# EAGLE board agatbreadboardshort (EAGLE 7.5.0), part 1 of 3
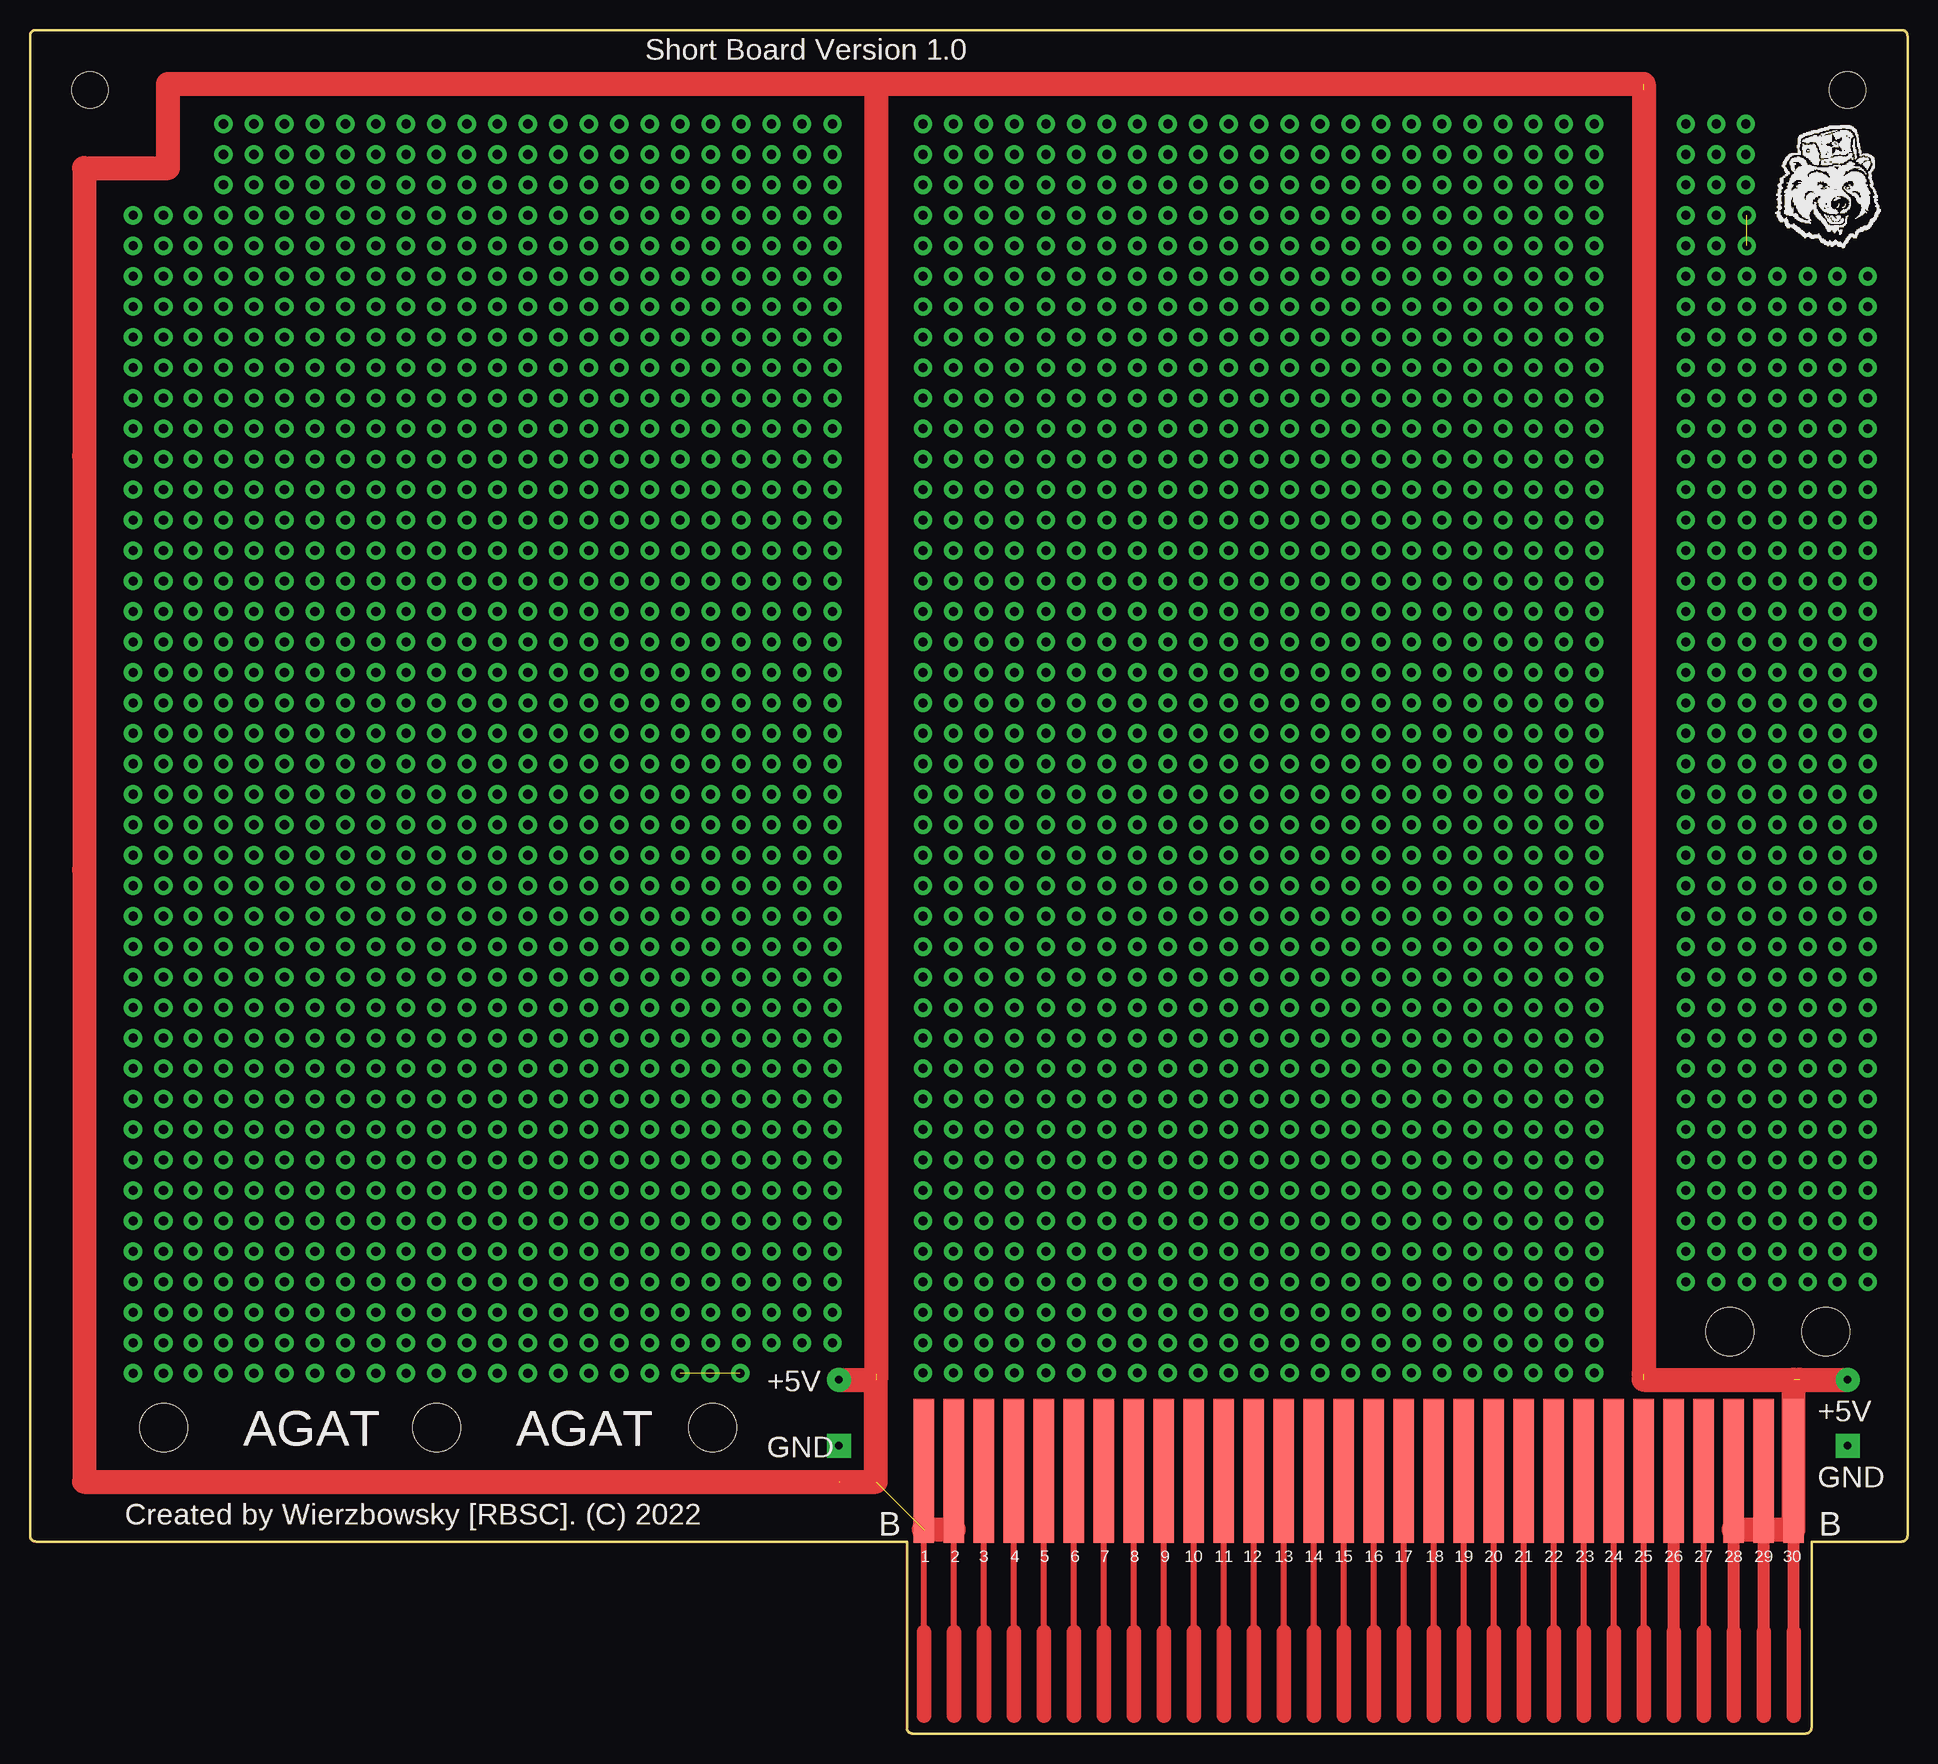
[diagram p1: board, top side]
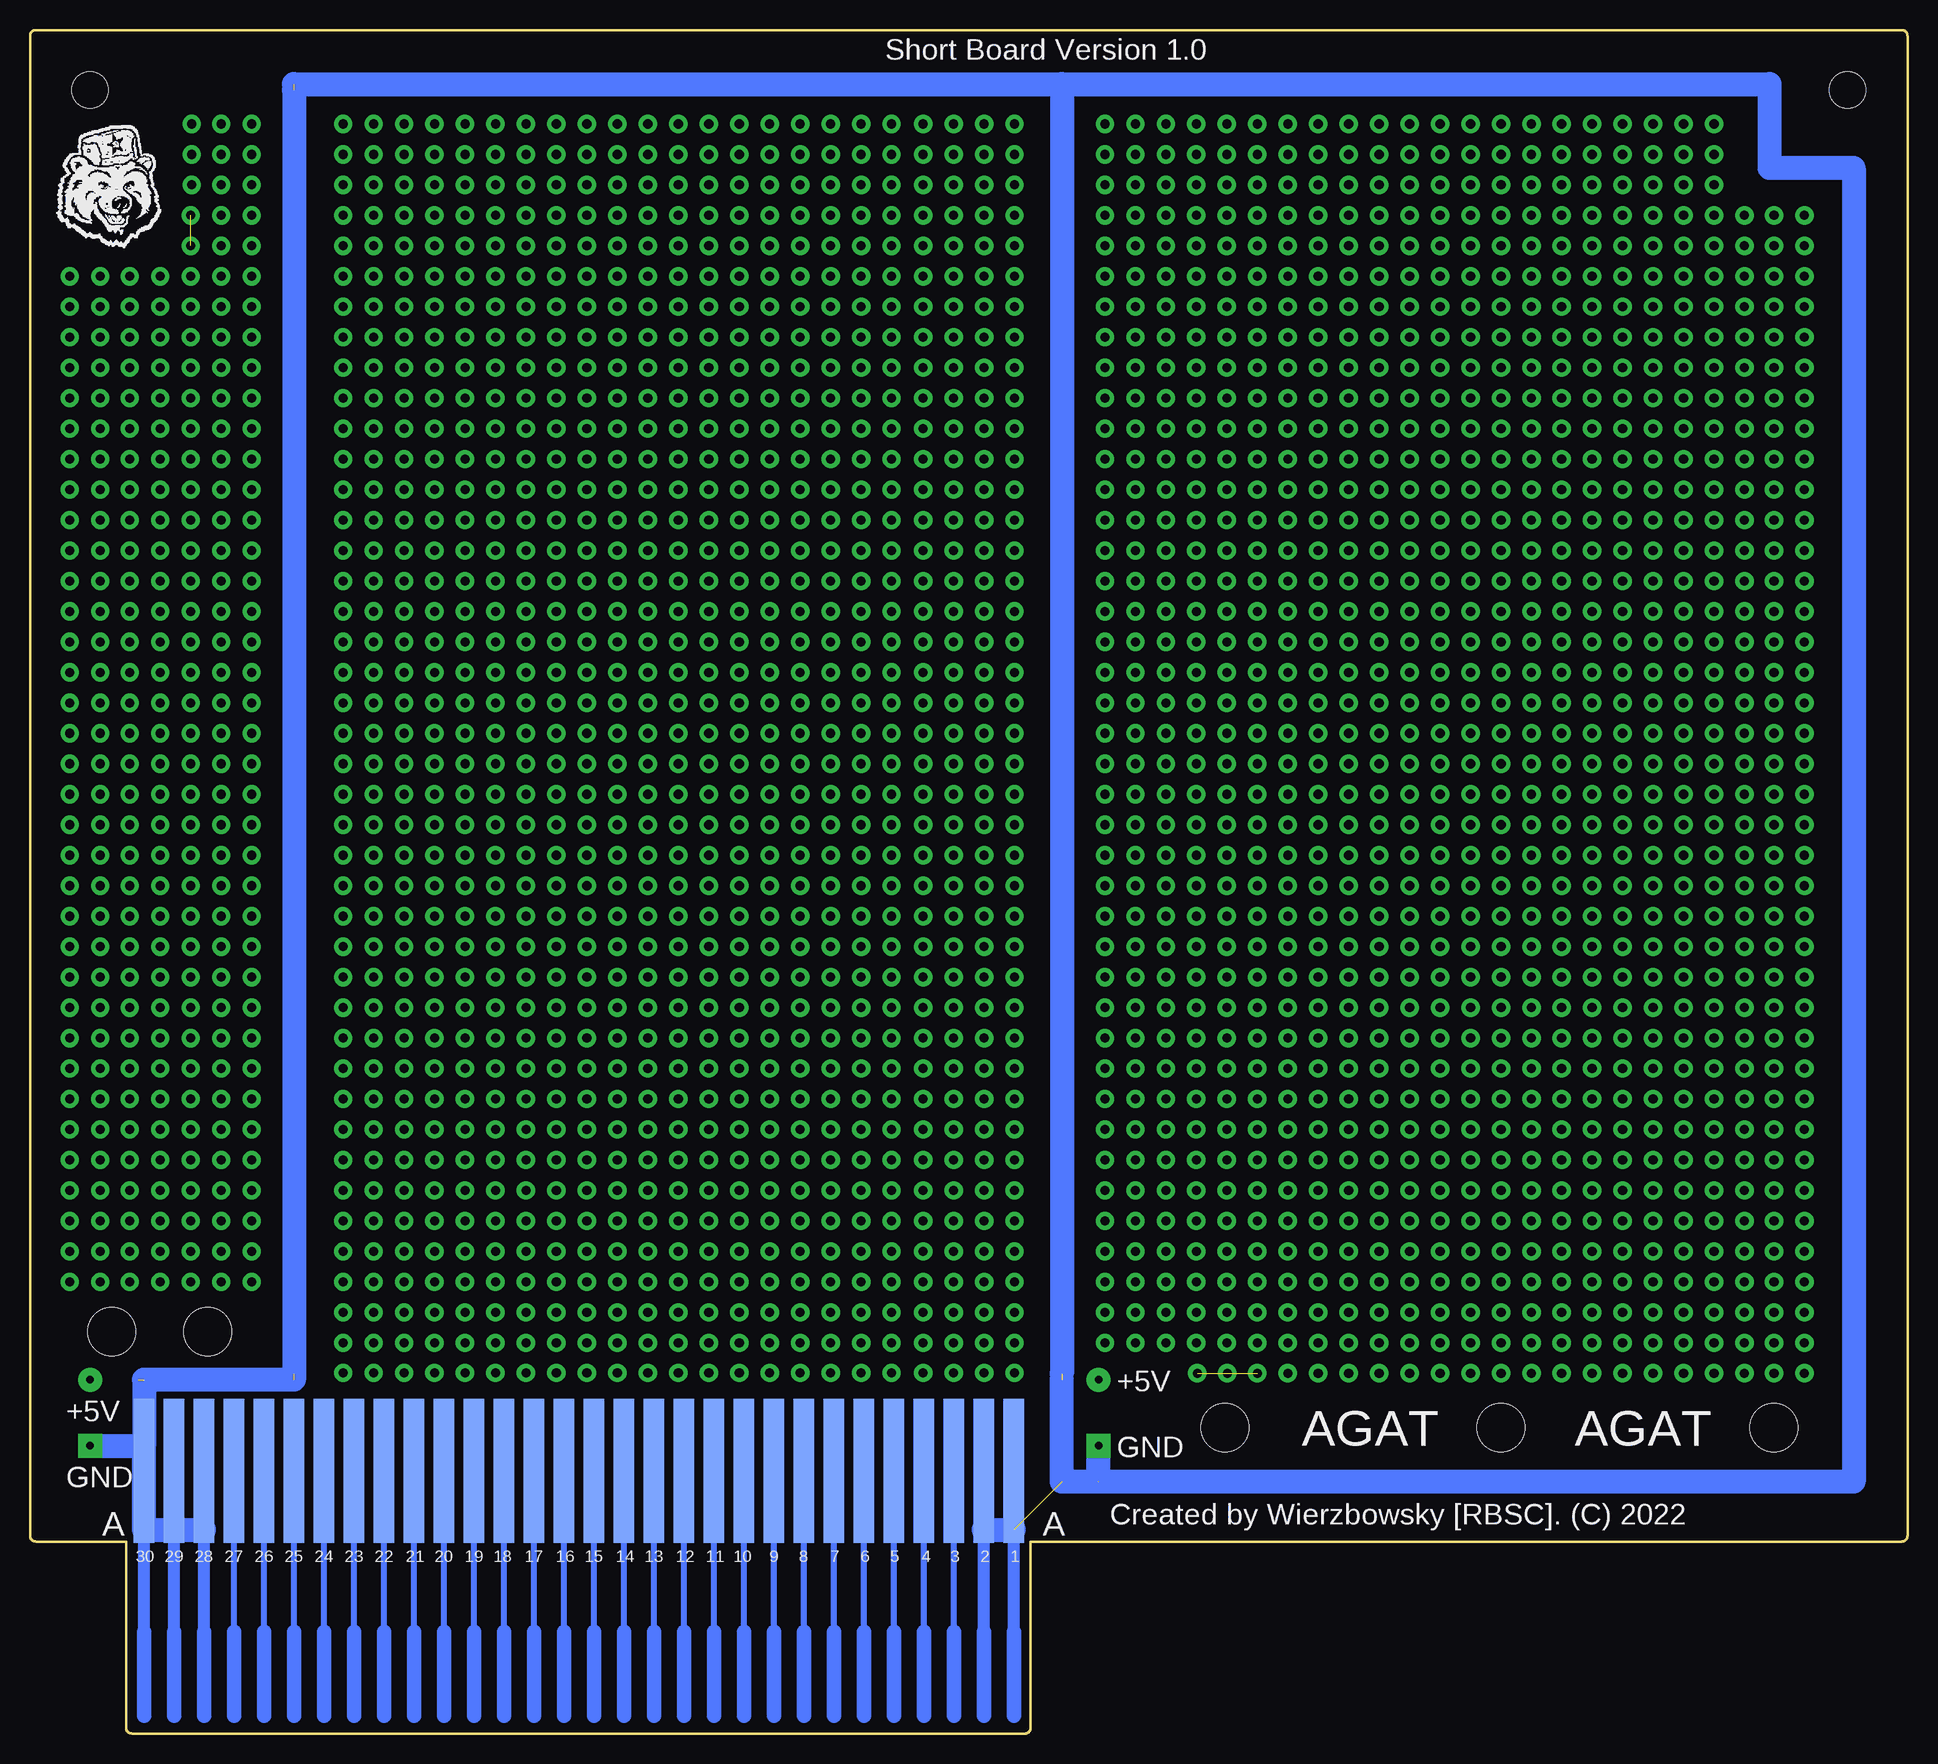
[diagram p2: board, bottom side, seen from below]

Size 156.5 x 142 mm. Coordinates in mm from the lower left corner, seen from the top.
Outline: 0.5,142 156,142 arc-90 156.5,141.5 156.5,16.5 arc-90 156,16 148.5,16 148.5,0.5 arc-90 148,0 73.5,0 arc-90 73.1,0.5 73.1,16 0.5,16 arc-90 0,16.5 0,141.5 arc-90 0.5,142
Copper layers (1*16): Top 0.035mm / dielectric 1.5mm / Bottom 0.035mm
Design rules "default": minimum track width 10mil, minimum drill 24mil, track to track 8mil, track to pad 8mil, pad to pad 8mil, via to via 8mil, smd to smd 8mil, copper to edge 40mil, drill to drill 8mil, minimum pad ring 10mil, minimum via ring 8mil, stop-mask expansion 4mil, vias tented up to drill 0mil, thermal gap 10mil
Holes 3 mm at 5,137 151.5,137
Holes 4 mm at 33.9,25.5 56.9,25.5 149.7,33.5 141.7,33.5 11.15,25.5

## Footprints (pad centres in the part's own frame; a part is rotated, then mirrored left to right if it is on the bottom)
AGAT_CONP = smd 1.7 x 12 bottom: A1 -75,21.9; A2 -72.5,21.9; A3 -70,21.9; A4 -67.5,21.9; A5 -65,21.9; A6 -62.5,21.9; A7 -60,21.9; A8 -57.5,21.9; A9 -55,21.9; A10 -52.5,21.9; A11 -50,21.9; A12 -47.5,21.9; A13 -45,21.9; A14 -42.5,21.9; A15 -40,21.9; A16 -37.5,21.9; A17 -35,21.9; A18 -32.5,21.9; A19 -30,21.9; A20 -27.5,21.9; A21 -25,21.9; A22 -22.5,21.9; A23 -20,21.9; A24 -17.5,21.9; A25 -15,21.9; A26 -12.5,21.9; A27 -10,21.9; A28 -7.5,21.9; A29 -5,21.9; A30 -2.5,21.9 | smd 1.7 x 12: B1 -75,21.9; B2 -72.5,21.9; B3 -70,21.9; B4 -67.5,21.9; B5 -65,21.9; B6 -62.5,21.9; B7 -60,21.9; B8 -57.5,21.9; B9 -55,21.9; B10 -52.5,21.9; B11 -50,21.9; B12 -47.5,21.9; B13 -45,21.9; B14 -42.5,21.9; B15 -40,21.9; B16 -37.5,21.9; B17 -35,21.9; B18 -32.5,21.9; B19 -30,21.9; B20 -27.5,21.9; B21 -25,21.9; B22 -22.5,21.9; B23 -20,21.9; B24 -17.5,21.9; B25 -15,21.9; B26 -12.5,21.9; B27 -10,21.9; B28 -7.5,21.9; B29 -5,21.9; B30 -2.5,21.9

## Placement (x,y rotation side)
EDG1  [AGAT_CONP]  149.5,0 0 top

## Tracks (layer width: path | path; a pad name or v marks a point on that pad's centre or on a via)
+5V  (via drill 0.6 pad 2)  (3 unrouted)
  Top 1: 4.5,106.54 4.5,106.5 | 4.5,71.54 4.5,72
  Top 2: 70.5,137.5 134.5,137.5 134.5,30 | 70.5,137.5 11.5,137.5 11.5,130.5 4.5,130.5 4.5,106.5 4.5,72 4.5,21 70.5,21 70.5,29.5 | 134.5,29.5 147,29.5 147,17 142,17 | 147.5,29.5 v151.5,29.5 | 70.5,137.5 70.5,29.5 | v67.42,29.5 70.5,29.5
  Bottom 2: 77,17 74.5,17
GND  (via drill 0.6 pad 2)  (3 unrouted)
  Bottom 2: 134.5,137.5 11.5,137.5 11.5,130.5 4.5,130.5 4.5,21 67.42,21 v67.42,24 | 67.5,21 70.5,21 70.5,29.5 | 70.5,137.5 70.5,30 | 134.5,137 134.5,29.5 147,29.5 147,24 | 147,24 147,17 142,17 | v151.5,24 147,24
HOLE1  (via drill 0.76 pad 1.52)
  other vias: 107.54,30.07
HOLE2  (via drill 0.76 pad 1.52)
  other vias: 97.38,30.07
HOLE3  (via drill 0.76 pad 1.52)
  other vias: 26.29,47.81
HOLE4  (via drill 0.76 pad 1.52)
  other vias: 26.29,50.35
HOLE5  (via drill 0.76 pad 1.52)
  other vias: 26.29,52.89
HOLE6  (via drill 0.76 pad 1.52)
  other vias: 26.29,55.43
HOLE7  (via drill 0.76 pad 1.52)
  other vias: 26.29,57.97
HOLE8  (via drill 0.76 pad 1.52)
  other vias: 26.29,60.51
HOLE9  (via drill 0.76 pad 1.52)
  other vias: 26.29,63.05
HOLE10  (via drill 0.76 pad 1.52)
  other vias: 26.29,65.59
HOLE11  (via drill 0.76 pad 1.52)
  other vias: 26.29,68.13
HOLE12  (via drill 0.76 pad 1.52)
  other vias: 26.29,70.67
HOLE13  (via drill 0.76 pad 1.52)
  other vias: 26.29,73.21
HOLE14  (via drill 0.76 pad 1.52)
  other vias: 26.29,75.75
HOLE15  (via drill 0.76 pad 1.52)
  other vias: 26.29,78.29
HOLE16  (via drill 0.76 pad 1.52)
  other vias: 26.29,80.83
HOLE17  (via drill 0.76 pad 1.52)
  other vias: 26.29,83.37
HOLE18  (via drill 0.76 pad 1.52)
  other vias: 26.29,85.91
HOLE19  (via drill 0.76 pad 1.52)
  other vias: 26.29,88.45
HOLE20  (via drill 0.76 pad 1.52)
  other vias: 26.29,90.99
HOLE21  (via drill 0.76 pad 1.52)
  other vias: 26.29,93.53
HOLE22  (via drill 0.76 pad 1.52)
  other vias: 26.29,96.07
HOLE23  (via drill 0.76 pad 1.52)
  other vias: 26.29,98.61
HOLE24  (via drill 0.76 pad 1.52)
  other vias: 26.29,101.15
HOLE25  (via drill 0.76 pad 1.52)
  other vias: 26.29,103.69
HOLE26  (via drill 0.76 pad 1.52)
  other vias: 26.29,106.23
HOLE27  (via drill 0.76 pad 1.52)
  other vias: 26.29,108.77
HOLE28  (via drill 0.76 pad 1.52)
  other vias: 26.29,111.31
HOLE29  (via drill 0.76 pad 1.52)
  other vias: 26.29,113.85
HOLE30  (via drill 0.76 pad 1.52)
  other vias: 26.29,116.39
HOLE31  (via drill 0.76 pad 1.52)
  other vias: 26.29,118.93
HOLE32  (via drill 0.76 pad 1.52)
  other vias: 26.29,121.47
HOLE33  (via drill 0.76 pad 1.52)
  other vias: 26.29,124.01
HOLE34  (via drill 0.76 pad 1.52)
  other vias: 26.29,126.55
HOLE35  (via drill 0.76 pad 1.52)
  other vias: 26.29,129.09
HOLE36  (via drill 0.76 pad 1.52)
  other vias: 26.29,131.63
HOLE37  (via drill 0.76 pad 1.52)
  other vias: 26.29,134.17
HOLE38  (via drill 0.76 pad 1.52)
  other vias: 26.29,30.03
HOLE39  (via drill 0.76 pad 1.52)
  other vias: 26.29,32.57
HOLE40  (via drill 0.76 pad 1.52)
  other vias: 26.29,35.11
HOLE41  (via drill 0.76 pad 1.52)
  other vias: 26.29,37.65
HOLE42  (via drill 0.76 pad 1.52)
  other vias: 26.29,40.19
HOLE43  (via drill 0.76 pad 1.52)
  other vias: 26.29,42.73
HOLE44  (via drill 0.76 pad 1.52)
  other vias: 26.29,45.27
HOLE279  (via drill 0.76 pad 1.52)
  other vias: 54.2,47.81
HOLE280  (via drill 0.76 pad 1.52)
  other vias: 44.04,47.81
HOLE281  (via drill 0.76 pad 1.52)
  other vias: 54.2,50.35
HOLE282  (via drill 0.76 pad 1.52)
  other vias: 44.04,50.35
HOLE283  (via drill 0.76 pad 1.52)
  other vias: 54.2,52.89
HOLE284  (via drill 0.76 pad 1.52)
  other vias: 44.04,52.89
HOLE285  (via drill 0.76 pad 1.52)
  other vias: 54.2,55.43
HOLE286  (via drill 0.76 pad 1.52)
  other vias: 44.04,55.43
HOLE287  (via drill 0.76 pad 1.52)
  other vias: 54.2,57.97
HOLE288  (via drill 0.76 pad 1.52)
  other vias: 44.04,57.97
HOLE289  (via drill 0.76 pad 1.52)
  other vias: 54.2,60.51
HOLE290  (via drill 0.76 pad 1.52)
  other vias: 44.04,60.51
HOLE291  (via drill 0.76 pad 1.52)
  other vias: 54.2,63.05
HOLE292  (via drill 0.76 pad 1.52)
  other vias: 44.04,63.05
HOLE293  (via drill 0.76 pad 1.52)
  other vias: 54.2,65.59
HOLE294  (via drill 0.76 pad 1.52)
  other vias: 44.04,65.59
HOLE295  (via drill 0.76 pad 1.52)
  other vias: 54.2,68.13
HOLE296  (via drill 0.76 pad 1.52)
  other vias: 44.04,68.13
HOLE297  (via drill 0.76 pad 1.52)
  other vias: 54.2,70.67
HOLE298  (via drill 0.76 pad 1.52)
  other vias: 44.04,70.67
HOLE299  (via drill 0.76 pad 1.52)
  other vias: 54.2,73.21
HOLE300  (via drill 0.76 pad 1.52)
  other vias: 44.04,73.21
HOLE301  (via drill 0.76 pad 1.52)
  other vias: 54.2,75.75
HOLE302  (via drill 0.76 pad 1.52)
  other vias: 44.04,75.75
HOLE303  (via drill 0.76 pad 1.52)
  other vias: 54.2,78.29
HOLE304  (via drill 0.76 pad 1.52)
  other vias: 44.04,78.29
HOLE305  (via drill 0.76 pad 1.52)
  other vias: 54.2,80.83
HOLE306  (via drill 0.76 pad 1.52)
  other vias: 44.04,80.83
HOLE307  (via drill 0.76 pad 1.52)
  other vias: 54.2,83.37
HOLE308  (via drill 0.76 pad 1.52)
  other vias: 44.04,83.37
HOLE309  (via drill 0.76 pad 1.52)
  other vias: 54.2,85.91
HOLE310  (via drill 0.76 pad 1.52)
  other vias: 44.04,85.91
HOLE311  (via drill 0.76 pad 1.52)
  other vias: 54.2,88.45
HOLE312  (via drill 0.76 pad 1.52)
  other vias: 44.04,88.45
HOLE313  (via drill 0.76 pad 1.52)
  other vias: 54.2,90.99
HOLE314  (via drill 0.76 pad 1.52)
  other vias: 44.04,90.99
HOLE315  (via drill 0.76 pad 1.52)
  other vias: 54.2,93.53
HOLE316  (via drill 0.76 pad 1.52)
  other vias: 44.04,93.53
HOLE317  (via drill 0.76 pad 1.52)
  other vias: 54.2,96.07
HOLE318  (via drill 0.76 pad 1.52)
  other vias: 44.04,96.07
HOLE319  (via drill 0.76 pad 1.52)
  other vias: 54.2,98.61
HOLE320  (via drill 0.76 pad 1.52)
  other vias: 44.04,98.61
HOLE321  (via drill 0.76 pad 1.52)
  other vias: 54.2,101.15
HOLE322  (via drill 0.76 pad 1.52)
  other vias: 44.04,101.15
HOLE323  (via drill 0.76 pad 1.52)
  other vias: 54.2,103.69
HOLE324  (via drill 0.76 pad 1.52)
  other vias: 44.04,103.69
HOLE325  (via drill 0.76 pad 1.52)
  other vias: 54.2,106.23
HOLE326  (via drill 0.76 pad 1.52)
  other vias: 44.04,106.23
HOLE327  (via drill 0.76 pad 1.52)
  other vias: 54.2,108.77
HOLE328  (via drill 0.76 pad 1.52)
  other vias: 44.04,108.77
HOLE329  (via drill 0.76 pad 1.52)
  other vias: 54.2,111.31
HOLE330  (via drill 0.76 pad 1.52)
  other vias: 44.04,111.31
HOLE331  (via drill 0.76 pad 1.52)
  other vias: 54.2,113.85
HOLE332  (via drill 0.76 pad 1.52)
  other vias: 44.04,113.85
HOLE333  (via drill 0.76 pad 1.52)
  other vias: 54.2,116.39
HOLE334  (via drill 0.76 pad 1.52)
  other vias: 44.04,116.39
HOLE335  (via drill 0.76 pad 1.52)
  other vias: 54.2,118.93
HOLE336  (via drill 0.76 pad 1.52)
  other vias: 44.04,118.93
HOLE337  (via drill 0.76 pad 1.52)
  other vias: 54.2,121.47
HOLE338  (via drill 0.76 pad 1.52)
  other vias: 44.04,121.47
HOLE339  (via drill 0.76 pad 1.52)
  other vias: 54.2,124.01
HOLE340  (via drill 0.76 pad 1.52)
  other vias: 44.04,124.01
HOLE341  (via drill 0.76 pad 1.52)
  other vias: 54.2,126.55
HOLE342  (via drill 0.76 pad 1.52)
  other vias: 44.04,126.55
HOLE343  (via drill 0.76 pad 1.52)
  other vias: 54.2,129.09
HOLE344  (via drill 0.76 pad 1.52)
  other vias: 44.04,129.09
HOLE345  (via drill 0.76 pad 1.52)
  other vias: 54.2,131.63
HOLE346  (via drill 0.76 pad 1.52)
  other vias: 44.04,131.63
HOLE347  (via drill 0.76 pad 1.52)
  other vias: 54.2,134.17
HOLE348  (via drill 0.76 pad 1.52)
  other vias: 44.04,134.17
HOLE349  (via drill 0.76 pad 1.52)  (2 unrouted)
  other vias: 54.2,30.03 56.7,30.03 59.2,30.03
HOLE350  (via drill 0.76 pad 1.52)
  other vias: 44.04,30.03
HOLE351  (via drill 0.76 pad 1.52)
  other vias: 54.2,32.57
HOLE352  (via drill 0.76 pad 1.52)
  other vias: 44.04,32.57
HOLE353  (via drill 0.76 pad 1.52)
  other vias: 54.2,35.11
HOLE354  (via drill 0.76 pad 1.52)
  other vias: 44.04,35.11
HOLE355  (via drill 0.76 pad 1.52)
  other vias: 54.2,37.65
HOLE356  (via drill 0.76 pad 1.52)
  other vias: 44.04,37.65
HOLE357  (via drill 0.76 pad 1.52)
  other vias: 54.2,40.19
HOLE358  (via drill 0.76 pad 1.52)
  other vias: 44.04,40.19
HOLE359  (via drill 0.76 pad 1.52)
  other vias: 54.2,42.73
HOLE360  (via drill 0.76 pad 1.52)
  other vias: 44.04,42.73
HOLE361  (via drill 0.76 pad 1.52)
  other vias: 54.2,45.27
HOLE362  (via drill 0.76 pad 1.52)
  other vias: 44.04,45.27
HOLE363  (via drill 0.76 pad 1.52)
  other vias: 107.54,47.81
HOLE364  (via drill 0.76 pad 1.52)
  other vias: 97.38,47.81
HOLE365  (via drill 0.76 pad 1.52)
  other vias: 107.54,50.35
HOLE366  (via drill 0.76 pad 1.52)
  other vias: 97.38,50.35
HOLE367  (via drill 0.76 pad 1.52)
  other vias: 107.54,52.89
HOLE368  (via drill 0.76 pad 1.52)
  other vias: 97.38,52.89
HOLE369  (via drill 0.76 pad 1.52)
  other vias: 107.54,55.43
HOLE370  (via drill 0.76 pad 1.52)
  other vias: 97.38,55.43
HOLE371  (via drill 0.76 pad 1.52)
  other vias: 107.54,57.97
HOLE372  (via drill 0.76 pad 1.52)
  other vias: 97.38,57.97
HOLE373  (via drill 0.76 pad 1.52)
  other vias: 107.54,60.51
HOLE374  (via drill 0.76 pad 1.52)
  other vias: 97.38,60.51
HOLE375  (via drill 0.76 pad 1.52)
  other vias: 107.54,63.05
HOLE376  (via drill 0.76 pad 1.52)
  other vias: 97.38,63.05
HOLE377  (via drill 0.76 pad 1.52)
  other vias: 107.54,65.59
HOLE378  (via drill 0.76 pad 1.52)
  other vias: 97.38,65.59
HOLE379  (via drill 0.76 pad 1.52)
  other vias: 107.54,68.13
HOLE380  (via drill 0.76 pad 1.52)
  other vias: 97.38,68.13
HOLE381  (via drill 0.76 pad 1.52)
  other vias: 107.54,70.67
HOLE382  (via drill 0.76 pad 1.52)
  other vias: 97.38,70.67
HOLE383  (via drill 0.76 pad 1.52)
  other vias: 107.54,73.21
HOLE384  (via drill 0.76 pad 1.52)
  other vias: 97.38,73.21
HOLE385  (via drill 0.76 pad 1.52)
  other vias: 107.54,75.75
HOLE386  (via drill 0.76 pad 1.52)
  other vias: 97.38,75.75
HOLE387  (via drill 0.76 pad 1.52)
  other vias: 107.54,78.29
HOLE388  (via drill 0.76 pad 1.52)
  other vias: 97.38,78.29
HOLE389  (via drill 0.76 pad 1.52)
  other vias: 107.54,80.83
HOLE390  (via drill 0.76 pad 1.52)
  other vias: 97.38,80.83
HOLE391  (via drill 0.76 pad 1.52)
  other vias: 107.54,83.37
HOLE392  (via drill 0.76 pad 1.52)
  other vias: 97.38,83.37
HOLE393  (via drill 0.76 pad 1.52)
  other vias: 107.54,85.91
HOLE394  (via drill 0.76 pad 1.52)
  other vias: 97.38,85.91
HOLE395  (via drill 0.76 pad 1.52)
  other vias: 107.54,88.45
HOLE396  (via drill 0.76 pad 1.52)
  other vias: 97.38,88.45
HOLE397  (via drill 0.76 pad 1.52)
  other vias: 107.54,90.99
HOLE398  (via drill 0.76 pad 1.52)
  other vias: 97.38,90.99
HOLE399  (via drill 0.76 pad 1.52)
  other vias: 107.54,93.53
HOLE400  (via drill 0.76 pad 1.52)
  other vias: 97.38,93.53
HOLE401  (via drill 0.76 pad 1.52)
  other vias: 107.54,96.07
HOLE402  (via drill 0.76 pad 1.52)
  other vias: 97.38,96.07
HOLE403  (via drill 0.76 pad 1.52)
  other vias: 107.54,98.61
HOLE404  (via drill 0.76 pad 1.52)
  other vias: 97.38,98.61
HOLE405  (via drill 0.76 pad 1.52)
  other vias: 107.54,101.15
HOLE406  (via drill 0.76 pad 1.52)
  other vias: 97.38,101.15
HOLE407  (via drill 0.76 pad 1.52)
  other vias: 107.54,103.69
HOLE408  (via drill 0.76 pad 1.52)
  other vias: 97.38,103.69
HOLE409  (via drill 0.76 pad 1.52)
  other vias: 107.54,106.23
HOLE410  (via drill 0.76 pad 1.52)
  other vias: 97.38,106.23
HOLE411  (via drill 0.76 pad 1.52)
  other vias: 107.54,108.77
HOLE412  (via drill 0.76 pad 1.52)
  other vias: 97.38,108.77
HOLE413  (via drill 0.76 pad 1.52)
  other vias: 107.54,111.31
HOLE414  (via drill 0.76 pad 1.52)
  other vias: 97.38,111.31
HOLE415  (via drill 0.76 pad 1.52)
  other vias: 107.54,113.85
HOLE416  (via drill 0.76 pad 1.52)
  other vias: 97.38,113.85
HOLE417  (via drill 0.76 pad 1.52)
  other vias: 107.54,116.39
HOLE418  (via drill 0.76 pad 1.52)
  other vias: 97.38,116.39
HOLE419  (via drill 0.76 pad 1.52)
  other vias: 107.54,118.93
HOLE420  (via drill 0.76 pad 1.52)
  other vias: 97.38,118.93
HOLE421  (via drill 0.76 pad 1.52)
  other vias: 107.54,121.47
HOLE422  (via drill 0.76 pad 1.52)
  other vias: 97.38,121.47
HOLE423  (via drill 0.76 pad 1.52)
  other vias: 107.54,124.01
HOLE424  (via drill 0.76 pad 1.52)
  other vias: 97.38,124.01
HOLE425  (via drill 0.76 pad 1.52)
  other vias: 107.54,126.55
HOLE426  (via drill 0.76 pad 1.52)
  other vias: 97.38,126.55
HOLE427  (via drill 0.76 pad 1.52)
  other vias: 107.54,129.09
HOLE428  (via drill 0.76 pad 1.52)
  other vias: 97.38,129.09
HOLE429  (via drill 0.76 pad 1.52)
  other vias: 107.54,131.63
HOLE430  (via drill 0.76 pad 1.52)
  other vias: 97.38,131.63
HOLE431  (via drill 0.76 pad 1.52)
  other vias: 107.54,134.17
HOLE432  (via drill 0.76 pad 1.52)
  other vias: 97.38,134.17
HOLE435  (via drill 0.76 pad 1.52)
  other vias: 107.54,32.57
HOLE436  (via drill 0.76 pad 1.52)
  other vias: 97.38,32.57
HOLE437  (via drill 0.76 pad 1.52)
  other vias: 107.54,35.11
HOLE438  (via drill 0.76 pad 1.52)
  other vias: 97.38,35.11
HOLE439  (via drill 0.76 pad 1.52)
  other vias: 107.54,37.65
HOLE440  (via drill 0.76 pad 1.52)
  other vias: 97.38,37.65
HOLE441  (via drill 0.76 pad 1.52)
  other vias: 107.54,40.19
HOLE442  (via drill 0.76 pad 1.52)
  other vias: 97.38,40.19
HOLE443  (via drill 0.76 pad 1.52)
  other vias: 107.54,42.73
HOLE444  (via drill 0.76 pad 1.52)
  other vias: 97.38,42.73
HOLE445  (via drill 0.76 pad 1.52)
  other vias: 107.54,45.27
HOLE446  (via drill 0.76 pad 1.52)
  other vias: 97.38,45.27
N$1  (via drill 0.76 pad 1.52)
  other vias: 112.62,30.07
N$2  (via drill 0.76 pad 1.52)
  other vias: 110.08,30.07
N$3  (via drill 0.76 pad 1.52)
  other vias: 117.7,30.07
N$4  (via drill 0.76 pad 1.52)
  other vias: 115.16,30.07
N$5  (via drill 0.76 pad 1.52)
  other vias: 122.78,30.07
N$6  (via drill 0.76 pad 1.52)
  other vias: 120.24,30.07
N$7  (via drill 0.76 pad 1.52)
  other vias: 127.86,30.07
N$8  (via drill 0.76 pad 1.52)
  other vias: 125.32,30.07
N$9  (via drill 0.76 pad 1.52)
  other vias: 130.4,30.07
N$10  (via drill 0.76 pad 1.52)
  other vias: 153.18,47.81
N$11  (via drill 0.76 pad 1.52)
  other vias: 150.64,47.81
N$12  (via drill 0.76 pad 1.52)
  other vias: 153.18,50.35
N$13  (via drill 0.76 pad 1.52)
  other vias: 150.64,50.35
N$14  (via drill 0.76 pad 1.52)
  other vias: 153.18,52.89
N$15  (via drill 0.76 pad 1.52)
  other vias: 150.64,52.89
N$16  (via drill 0.76 pad 1.52)
  other vias: 153.18,55.43
N$17  (via drill 0.76 pad 1.52)
  other vias: 150.64,55.43
N$18  (via drill 0.76 pad 1.52)
  other vias: 153.18,57.97
N$19  (via drill 0.76 pad 1.52)
  other vias: 150.64,57.97
N$20  (via drill 0.76 pad 1.52)
  other vias: 153.18,60.51
N$21  (via drill 0.76 pad 1.52)
  other vias: 150.64,60.51
N$22  (via drill 0.76 pad 1.52)
  other vias: 153.18,63.05
N$23  (via drill 0.76 pad 1.52)
  other vias: 150.64,63.05
N$24  (via drill 0.76 pad 1.52)
  other vias: 153.18,65.59
N$25  (via drill 0.76 pad 1.52)
  other vias: 150.64,65.59
N$26  (via drill 0.76 pad 1.52)
  other vias: 153.18,68.13
N$27  (via drill 0.76 pad 1.52)
  other vias: 150.64,68.13
N$28  (via drill 0.76 pad 1.52)
  other vias: 153.18,70.67
N$29  (via drill 0.76 pad 1.52)
  other vias: 150.64,70.67
N$30  (via drill 0.76 pad 1.52)
  other vias: 153.18,73.21
N$31  (via drill 0.76 pad 1.52)
  other vias: 150.64,73.21
N$32  (via drill 0.76 pad 1.52)
  other vias: 153.18,75.75
N$33  (via drill 0.76 pad 1.52)
  other vias: 150.64,75.75
N$34  (via drill 0.76 pad 1.52)
  other vias: 153.18,78.29
N$35  (via drill 0.76 pad 1.52)
  other vias: 150.64,78.29
N$36  (via drill 0.76 pad 1.52)
  other vias: 153.18,80.83
N$37  (via drill 0.76 pad 1.52)
  other vias: 150.64,80.83
N$38  (via drill 0.76 pad 1.52)
  other vias: 153.18,83.37
N$39  (via drill 0.76 pad 1.52)
  other vias: 150.64,83.37
N$40  (via drill 0.76 pad 1.52)
  other vias: 153.18,85.91
N$41  (via drill 0.76 pad 1.52)
  other vias: 150.64,85.91
N$42  (via drill 0.76 pad 1.52)
  other vias: 153.18,88.45
N$43  (via drill 0.76 pad 1.52)
  other vias: 150.64,88.45
N$44  (via drill 0.76 pad 1.52)
  other vias: 153.18,90.99
N$45  (via drill 0.76 pad 1.52)
  other vias: 150.64,90.99
N$46  (via drill 0.76 pad 1.52)
  other vias: 153.18,93.53
N$47  (via drill 0.76 pad 1.52)
  other vias: 150.64,93.53
N$48  (via drill 0.76 pad 1.52)
  other vias: 153.18,96.07
N$49  (via drill 0.76 pad 1.52)
  other vias: 150.64,96.07
N$50  (via drill 0.76 pad 1.52)
  other vias: 153.18,98.61
N$51  (via drill 0.76 pad 1.52)
  other vias: 150.64,98.61
N$52  (via drill 0.76 pad 1.52)
  other vias: 153.18,101.15
N$53  (via drill 0.76 pad 1.52)
  other vias: 150.64,101.15
N$54  (via drill 0.76 pad 1.52)
  other vias: 153.18,103.69
N$55  (via drill 0.76 pad 1.52)
  other vias: 150.64,103.69
N$56  (via drill 0.76 pad 1.52)
  other vias: 153.18,106.23
N$57  (via drill 0.76 pad 1.52)
  other vias: 150.64,106.23
N$58  (via drill 0.76 pad 1.52)
  other vias: 153.18,108.77
N$59  (via drill 0.76 pad 1.52)
  other vias: 150.64,108.77
N$60  (via drill 0.76 pad 1.52)
  other vias: 153.18,111.31
N$61  (via drill 0.76 pad 1.52)
  other vias: 150.64,111.31
N$62  (via drill 0.76 pad 1.52)
  other vias: 153.18,113.85
N$63  (via drill 0.76 pad 1.52)
  other vias: 150.64,113.85
N$64  (via drill 0.76 pad 1.52)
  other vias: 153.18,116.39
N$65  (via drill 0.76 pad 1.52)
  other vias: 150.64,116.39
N$66  (via drill 0.76 pad 1.52)
  other vias: 153.18,118.93
N$67  (via drill 0.76 pad 1.52)
  other vias: 150.64,118.93
N$68  (via drill 0.76 pad 1.52)
  other vias: 153.18,121.47
N$69  (via drill 0.76 pad 1.52)
  other vias: 150.64,121.47
N$70  (via drill 0.76 pad 1.52)
  other vias: 99.92,30.07
N$71  (via drill 0.76 pad 1.52)
  other vias: 102.46,30.07
N$72  (via drill 0.76 pad 1.52)
  other vias: 105,30.07
N$73  (via drill 0.76 pad 1.52)
  other vias: 84.68,30.07
N$74  (via drill 0.76 pad 1.52)
  other vias: 87.22,30.07
N$75  (via drill 0.76 pad 1.52)
  other vias: 89.76,30.07
N$76  (via drill 0.76 pad 1.52)
  other vias: 153.18,37.65
N$77  (via drill 0.76 pad 1.52)
  other vias: 150.64,37.65
N$78  (via drill 0.76 pad 1.52)
  other vias: 153.18,40.19
N$79  (via drill 0.76 pad 1.52)
  other vias: 150.64,40.19
N$80  (via drill 0.76 pad 1.52)
  other vias: 153.18,42.73
N$81  (via drill 0.76 pad 1.52)
  other vias: 150.64,42.73
N$82  (via drill 0.76 pad 1.52)
  other vias: 153.18,45.27
N$83  (via drill 0.76 pad 1.52)
  other vias: 150.64,45.27
N$84  (via drill 0.76 pad 1.52)
  other vias: 143.02,129.09
N$85  (via drill 0.76 pad 1.52)
  other vias: 92.3,30.07
N$86  (via drill 0.76 pad 1.52)
  other vias: 143.02,131.63
N$87  (via drill 0.76 pad 1.52)
  other vias: 94.84,30.07
N$88  (via drill 0.76 pad 1.52)
  other vias: 143.02,134.17
N$89
  Top 2: 77,17 74.5,17
N$90  (via drill 0.76 pad 1.52)
  other vias: 28.83,47.81
N$91  (via drill 0.76 pad 1.52)
  other vias: 13.59,47.81
N$92  (via drill 0.76 pad 1.52)
  other vias: 16.13,47.81
N$93  (via drill 0.76 pad 1.52)
  other vias: 18.67,47.81
N$94  (via drill 0.76 pad 1.52)
  other vias: 21.21,47.81
N$95  (via drill 0.76 pad 1.52)
  other vias: 23.75,47.81
N$96  (via drill 0.76 pad 1.52)
  other vias: 28.83,50.35
N$97  (via drill 0.76 pad 1.52)
  other vias: 13.59,50.35
N$98  (via drill 0.76 pad 1.52)
  other vias: 16.13,50.35
N$99  (via drill 0.76 pad 1.52)
  other vias: 18.67,50.35
N$100  (via drill 0.76 pad 1.52)
  other vias: 21.21,50.35
N$101  (via drill 0.76 pad 1.52)
  other vias: 23.75,50.35
N$102  (via drill 0.76 pad 1.52)
  other vias: 28.83,52.89
N$103  (via drill 0.76 pad 1.52)
  other vias: 13.59,52.89
N$104  (via drill 0.76 pad 1.52)
  other vias: 16.13,52.89
N$105  (via drill 0.76 pad 1.52)
  other vias: 18.67,52.89
N$106  (via drill 0.76 pad 1.52)
  other vias: 21.21,52.89
N$107  (via drill 0.76 pad 1.52)
  other vias: 23.75,52.89
N$108  (via drill 0.76 pad 1.52)
  other vias: 28.83,55.43
N$109  (via drill 0.76 pad 1.52)
  other vias: 13.59,55.43
N$110  (via drill 0.76 pad 1.52)
  other vias: 16.13,55.43
N$111  (via drill 0.76 pad 1.52)
  other vias: 18.67,55.43
N$112  (via drill 0.76 pad 1.52)
  other vias: 21.21,55.43
N$113  (via drill 0.76 pad 1.52)
  other vias: 23.75,55.43
N$114  (via drill 0.76 pad 1.52)
  other vias: 28.83,57.97
N$115  (via drill 0.76 pad 1.52)
  other vias: 13.59,57.97
N$116  (via drill 0.76 pad 1.52)
  other vias: 16.13,57.97
N$117  (via drill 0.76 pad 1.52)
  other vias: 18.67,57.97
N$118  (via drill 0.76 pad 1.52)
  other vias: 21.21,57.97
N$119  (via drill 0.76 pad 1.52)
  other vias: 23.75,57.97
N$120  (via drill 0.76 pad 1.52)
  other vias: 28.83,60.51
N$121  (via drill 0.76 pad 1.52)
  other vias: 13.59,60.51
N$122  (via drill 0.76 pad 1.52)
  other vias: 16.13,60.51
N$123  (via drill 0.76 pad 1.52)
  other vias: 18.67,60.51
N$124  (via drill 0.76 pad 1.52)
  other vias: 21.21,60.51
N$125  (via drill 0.76 pad 1.52)
  other vias: 23.75,60.51
N$126  (via drill 0.76 pad 1.52)
  other vias: 28.83,63.05
N$127  (via drill 0.76 pad 1.52)
  other vias: 13.59,63.05
N$128  (via drill 0.76 pad 1.52)
  other vias: 16.13,63.05
N$129  (via drill 0.76 pad 1.52)
  other vias: 18.67,63.05
N$130  (via drill 0.76 pad 1.52)
  other vias: 21.21,63.05
N$131  (via drill 0.76 pad 1.52)
  other vias: 23.75,63.05
N$132  (via drill 0.76 pad 1.52)
  other vias: 28.83,65.59
N$133  (via drill 0.76 pad 1.52)
  other vias: 13.59,65.59
N$134  (via drill 0.76 pad 1.52)
  other vias: 16.13,65.59
N$135  (via drill 0.76 pad 1.52)
  other vias: 18.67,65.59
N$136  (via drill 0.76 pad 1.52)
  other vias: 21.21,65.59
N$137  (via drill 0.76 pad 1.52)
  other vias: 23.75,65.59
N$138  (via drill 0.76 pad 1.52)
  other vias: 28.83,68.13
N$139  (via drill 0.76 pad 1.52)
  other vias: 13.59,68.13
N$140  (via drill 0.76 pad 1.52)
  other vias: 16.13,68.13
N$141  (via drill 0.76 pad 1.52)
  other vias: 18.67,68.13
N$142  (via drill 0.76 pad 1.52)
  other vias: 21.21,68.13
N$143  (via drill 0.76 pad 1.52)
  other vias: 23.75,68.13
N$144  (via drill 0.76 pad 1.52)
  other vias: 28.83,70.67
N$145  (via drill 0.76 pad 1.52)
  other vias: 13.59,70.67
N$146  (via drill 0.76 pad 1.52)
  other vias: 16.13,70.67
N$147  (via drill 0.76 pad 1.52)
  other vias: 18.67,70.67
N$148  (via drill 0.76 pad 1.52)
  other vias: 21.21,70.67
N$149  (via drill 0.76 pad 1.52)
  other vias: 23.75,70.67
N$150  (via drill 0.76 pad 1.52)
  other vias: 28.83,73.21
N$151  (via drill 0.76 pad 1.52)
  other vias: 13.59,73.21
N$152  (via drill 0.76 pad 1.52)
  other vias: 16.13,73.21
N$153  (via drill 0.76 pad 1.52)
  other vias: 18.67,73.21
N$154  (via drill 0.76 pad 1.52)
  other vias: 21.21,73.21
N$155  (via drill 0.76 pad 1.52)
  other vias: 23.75,73.21
N$156  (via drill 0.76 pad 1.52)
  other vias: 28.83,75.75
N$157  (via drill 0.76 pad 1.52)
  other vias: 13.59,75.75
N$158  (via drill 0.76 pad 1.52)
  other vias: 16.13,75.75
N$159  (via drill 0.76 pad 1.52)
  other vias: 18.67,75.75
N$160  (via drill 0.76 pad 1.52)
  other vias: 21.21,75.75
N$161  (via drill 0.76 pad 1.52)
  other vias: 23.75,75.75
N$162  (via drill 0.76 pad 1.52)
  other vias: 28.83,78.29
N$163  (via drill 0.76 pad 1.52)
  other vias: 13.59,78.29
N$164  (via drill 0.76 pad 1.52)
  other vias: 16.13,78.29
N$165  (via drill 0.76 pad 1.52)
  other vias: 18.67,78.29
N$166  (via drill 0.76 pad 1.52)
  other vias: 21.21,78.29
N$167  (via drill 0.76 pad 1.52)
  other vias: 23.75,78.29
N$168  (via drill 0.76 pad 1.52)
  other vias: 28.83,80.83
N$169  (via drill 0.76 pad 1.52)
  other vias: 13.59,80.83
N$170  (via drill 0.76 pad 1.52)
  other vias: 16.13,80.83
N$171  (via drill 0.76 pad 1.52)
  other vias: 18.67,80.83
N$172  (via drill 0.76 pad 1.52)
  other vias: 21.21,80.83
N$173  (via drill 0.76 pad 1.52)
  other vias: 23.75,80.83
N$174  (via drill 0.76 pad 1.52)
  other vias: 28.83,83.37
N$175  (via drill 0.76 pad 1.52)
  other vias: 13.59,83.37
N$176  (via drill 0.76 pad 1.52)
  other vias: 16.13,83.37
N$177  (via drill 0.76 pad 1.52)
  other vias: 18.67,83.37
N$178  (via drill 0.76 pad 1.52)
  other vias: 21.21,83.37
N$179  (via drill 0.76 pad 1.52)
  other vias: 23.75,83.37
N$180  (via drill 0.76 pad 1.52)
  other vias: 28.83,85.91
N$181  (via drill 0.76 pad 1.52)
  other vias: 13.59,85.91
N$182  (via drill 0.76 pad 1.52)
  other vias: 16.13,85.91
N$183  (via drill 0.76 pad 1.52)
  other vias: 18.67,85.91
N$184  (via drill 0.76 pad 1.52)
  other vias: 21.21,85.91
N$185  (via drill 0.76 pad 1.52)
  other vias: 23.75,85.91
N$186  (via drill 0.76 pad 1.52)
  other vias: 28.83,88.45
N$187  (via drill 0.76 pad 1.52)
  other vias: 13.59,88.45
N$188  (via drill 0.76 pad 1.52)
  other vias: 16.13,88.45
N$189  (via drill 0.76 pad 1.52)
  other vias: 18.67,88.45
N$190  (via drill 0.76 pad 1.52)
  other vias: 21.21,88.45
N$191  (via drill 0.76 pad 1.52)
  other vias: 23.75,88.45
N$192  (via drill 0.76 pad 1.52)
  other vias: 28.83,90.99
N$193  (via drill 0.76 pad 1.52)
  other vias: 13.59,90.99
N$194  (via drill 0.76 pad 1.52)
  other vias: 16.13,90.99
N$195  (via drill 0.76 pad 1.52)
  other vias: 18.67,90.99
N$196  (via drill 0.76 pad 1.52)
  other vias: 21.21,90.99
N$197  (via drill 0.76 pad 1.52)
  other vias: 23.75,90.99
N$198  (via drill 0.76 pad 1.52)
  other vias: 28.83,93.53
N$199  (via drill 0.76 pad 1.52)
  other vias: 13.59,93.53
N$200  (via drill 0.76 pad 1.52)
  other vias: 16.13,93.53
N$201  (via drill 0.76 pad 1.52)
  other vias: 18.67,93.53
N$202  (via drill 0.76 pad 1.52)
  other vias: 21.21,93.53
N$203  (via drill 0.76 pad 1.52)
  other vias: 23.75,93.53
N$204  (via drill 0.76 pad 1.52)
  other vias: 28.83,96.07
N$205  (via drill 0.76 pad 1.52)
  other vias: 13.59,96.07
N$206  (via drill 0.76 pad 1.52)
  other vias: 16.13,96.07
N$207  (via drill 0.76 pad 1.52)
  other vias: 18.67,96.07
N$208  (via drill 0.76 pad 1.52)
  other vias: 21.21,96.07
N$209  (via drill 0.76 pad 1.52)
  other vias: 23.75,96.07
N$210  (via drill 0.76 pad 1.52)
  other vias: 28.83,98.61
N$211  (via drill 0.76 pad 1.52)
  other vias: 13.59,98.61
N$212  (via drill 0.76 pad 1.52)
  other vias: 16.13,98.61
N$213  (via drill 0.76 pad 1.52)
  other vias: 18.67,98.61
N$214  (via drill 0.76 pad 1.52)
  other vias: 21.21,98.61
N$215  (via drill 0.76 pad 1.52)
  other vias: 23.75,98.61
N$216  (via drill 0.76 pad 1.52)
  other vias: 28.83,101.15
N$217  (via drill 0.76 pad 1.52)
  other vias: 13.59,101.15
N$218  (via drill 0.76 pad 1.52)
  other vias: 16.13,101.15
N$219  (via drill 0.76 pad 1.52)
  other vias: 18.67,101.15
N$220  (via drill 0.76 pad 1.52)
  other vias: 21.21,101.15
N$221  (via drill 0.76 pad 1.52)
  other vias: 23.75,101.15
N$222  (via drill 0.76 pad 1.52)
  other vias: 28.83,103.69
N$223  (via drill 0.76 pad 1.52)
  other vias: 13.59,103.69
N$224  (via drill 0.76 pad 1.52)
  other vias: 16.13,103.69
N$225  (via drill 0.76 pad 1.52)
  other vias: 18.67,103.69
N$226  (via drill 0.76 pad 1.52)
  other vias: 21.21,103.69
N$227  (via drill 0.76 pad 1.52)
  other vias: 23.75,103.69
N$228  (via drill 0.76 pad 1.52)
  other vias: 28.83,106.23
N$229  (via drill 0.76 pad 1.52)
  other vias: 13.59,106.23
N$230  (via drill 0.76 pad 1.52)
  other vias: 16.13,106.23
N$231  (via drill 0.76 pad 1.52)
  other vias: 18.67,106.23
N$232  (via drill 0.76 pad 1.52)
  other vias: 21.21,106.23
N$233  (via drill 0.76 pad 1.52)
  other vias: 23.75,106.23
N$234  (via drill 0.76 pad 1.52)
  other vias: 28.83,108.77
N$235  (via drill 0.76 pad 1.52)
  other vias: 13.59,108.77
N$236  (via drill 0.76 pad 1.52)
  other vias: 16.13,108.77
N$237  (via drill 0.76 pad 1.52)
  other vias: 18.67,108.77
N$238  (via drill 0.76 pad 1.52)
  other vias: 21.21,108.77
N$239  (via drill 0.76 pad 1.52)
  other vias: 23.75,108.77
N$240  (via drill 0.76 pad 1.52)
  other vias: 28.83,111.31
N$241  (via drill 0.76 pad 1.52)
  other vias: 13.59,111.31
N$242  (via drill 0.76 pad 1.52)
  other vias: 16.13,111.31
N$243  (via drill 0.76 pad 1.52)
  other vias: 18.67,111.31
N$244  (via drill 0.76 pad 1.52)
  other vias: 21.21,111.31
N$245  (via drill 0.76 pad 1.52)
  other vias: 23.75,111.31
N$246  (via drill 0.76 pad 1.52)
  other vias: 28.83,113.85
N$247  (via drill 0.76 pad 1.52)
  other vias: 13.59,113.85
N$248  (via drill 0.76 pad 1.52)
  other vias: 16.13,113.85
N$249  (via drill 0.76 pad 1.52)
  other vias: 18.67,113.85
N$250  (via drill 0.76 pad 1.52)
  other vias: 21.21,113.85
N$251  (via drill 0.76 pad 1.52)
  other vias: 23.75,113.85
N$252  (via drill 0.76 pad 1.52)
  other vias: 28.83,116.39
N$253  (via drill 0.76 pad 1.52)
  other vias: 13.59,116.39
N$254  (via drill 0.76 pad 1.52)
  other vias: 16.13,116.39
N$255  (via drill 0.76 pad 1.52)
  other vias: 18.67,116.39
N$256  (via drill 0.76 pad 1.52)
  other vias: 21.21,116.39
N$257  (via drill 0.76 pad 1.52)
  other vias: 23.75,116.39
N$258  (via drill 0.76 pad 1.52)
  other vias: 28.83,118.93
N$259  (via drill 0.76 pad 1.52)
  other vias: 13.59,118.93
N$260  (via drill 0.76 pad 1.52)
  other vias: 16.13,118.93
N$261  (via drill 0.76 pad 1.52)
  other vias: 18.67,118.93
N$262  (via drill 0.76 pad 1.52)
  other vias: 21.21,118.93
N$263  (via drill 0.76 pad 1.52)
  other vias: 23.75,118.93
N$264  (via drill 0.76 pad 1.52)
  other vias: 28.83,121.47
N$265  (via drill 0.76 pad 1.52)
  other vias: 13.59,121.47
N$266  (via drill 0.76 pad 1.52)
  other vias: 16.13,121.47
N$267  (via drill 0.76 pad 1.52)
  other vias: 18.67,121.47
N$268  (via drill 0.76 pad 1.52)
  other vias: 21.21,121.47
N$269  (via drill 0.76 pad 1.52)
  other vias: 23.75,121.47
N$270  (via drill 0.76 pad 1.52)
  other vias: 28.83,124.01
N$271  (via drill 0.76 pad 1.52)
  other vias: 13.59,124.01
N$272  (via drill 0.76 pad 1.52)
  other vias: 16.13,124.01
N$273  (via drill 0.76 pad 1.52)
  other vias: 18.67,124.01
N$274  (via drill 0.76 pad 1.52)
  other vias: 21.21,124.01
N$275  (via drill 0.76 pad 1.52)
  other vias: 23.75,124.01
N$276  (via drill 0.76 pad 1.52)
  other vias: 28.83,126.55
N$277  (via drill 0.76 pad 1.52)
  other vias: 13.59,126.55
N$278  (via drill 0.76 pad 1.52)
  other vias: 16.13,126.55
N$279  (via drill 0.76 pad 1.52)
  other vias: 18.67,126.55
N$280  (via drill 0.76 pad 1.52)
  other vias: 21.21,126.55
N$281  (via drill 0.76 pad 1.52)
  other vias: 23.75,126.55
N$282  (via drill 0.76 pad 1.52)
  other vias: 28.83,129.09
N$283  (via drill 0.76 pad 1.52)
  other vias: 8.59,47.81
N$284  (via drill 0.76 pad 1.52)
  other vias: 16.13,129.09
N$285  (via drill 0.76 pad 1.52)
  other vias: 18.67,129.09
N$286  (via drill 0.76 pad 1.52)
  other vias: 21.21,129.09
N$287  (via drill 0.76 pad 1.52)
  other vias: 23.75,129.09
N$288  (via drill 0.76 pad 1.52)
  other vias: 28.83,131.63
N$289  (via drill 0.76 pad 1.52)
  other vias: 11.13,47.81
N$290  (via drill 0.76 pad 1.52)
  other vias: 16.13,131.63
N$291  (via drill 0.76 pad 1.52)
  other vias: 18.67,131.63
N$292  (via drill 0.76 pad 1.52)
  other vias: 21.21,131.63
N$293  (via drill 0.76 pad 1.52)
  other vias: 23.75,131.63
N$294  (via drill 0.76 pad 1.52)
  other vias: 28.83,134.17
N$295  (via drill 0.76 pad 1.52)
  other vias: 8.59,50.35
N$296  (via drill 0.76 pad 1.52)
  other vias: 16.13,134.17
N$297  (via drill 0.76 pad 1.52)
  other vias: 18.67,134.17
N$298  (via drill 0.76 pad 1.52)
  other vias: 21.21,134.17
N$299  (via drill 0.76 pad 1.52)
  other vias: 23.75,134.17
N$300  (via drill 0.76 pad 1.52)
  other vias: 28.83,30.03
N$301  (via drill 0.76 pad 1.52)
  other vias: 13.59,30.03
N$302  (via drill 0.76 pad 1.52)
  other vias: 16.13,30.03
N$303  (via drill 0.76 pad 1.52)
  other vias: 18.67,30.03
N$304  (via drill 0.76 pad 1.52)
  other vias: 21.21,30.03
N$305  (via drill 0.76 pad 1.52)
  other vias: 23.75,30.03
N$306  (via drill 0.76 pad 1.52)
  other vias: 28.83,32.57
N$307  (via drill 0.76 pad 1.52)
  other vias: 13.59,32.57
N$308  (via drill 0.76 pad 1.52)
  other vias: 16.13,32.57
N$309  (via drill 0.76 pad 1.52)
  other vias: 18.67,32.57
N$310  (via drill 0.76 pad 1.52)
  other vias: 21.21,32.57
N$311  (via drill 0.76 pad 1.52)
  other vias: 23.75,32.57
N$312  (via drill 0.76 pad 1.52)
  other vias: 28.83,35.11
N$313  (via drill 0.76 pad 1.52)
  other vias: 13.59,35.11
N$314  (via drill 0.76 pad 1.52)
  other vias: 16.13,35.11
N$315  (via drill 0.76 pad 1.52)
  other vias: 18.67,35.11
N$316  (via drill 0.76 pad 1.52)
  other vias: 21.21,35.11
N$317  (via drill 0.76 pad 1.52)
  other vias: 23.75,35.11
N$318  (via drill 0.76 pad 1.52)
  other vias: 28.83,37.65
N$319  (via drill 0.76 pad 1.52)
  other vias: 13.59,37.65
N$320  (via drill 0.76 pad 1.52)
  other vias: 16.13,37.65
N$321  (via drill 0.76 pad 1.52)
  other vias: 18.67,37.65
N$322  (via drill 0.76 pad 1.52)
  other vias: 21.21,37.65
N$323  (via drill 0.76 pad 1.52)
  other vias: 23.75,37.65
N$324  (via drill 0.76 pad 1.52)
  other vias: 28.83,40.19
N$325  (via drill 0.76 pad 1.52)
  other vias: 13.59,40.19
N$326  (via drill 0.76 pad 1.52)
  other vias: 16.13,40.19
N$327  (via drill 0.76 pad 1.52)
  other vias: 18.67,40.19
N$328  (via drill 0.76 pad 1.52)
  other vias: 21.21,40.19
N$329  (via drill 0.76 pad 1.52)
  other vias: 23.75,40.19
N$330  (via drill 0.76 pad 1.52)
  other vias: 28.83,42.73
N$331  (via drill 0.76 pad 1.52)
  other vias: 13.59,42.73
N$332  (via drill 0.76 pad 1.52)
  other vias: 16.13,42.73
N$333  (via drill 0.76 pad 1.52)
  other vias: 18.67,42.73
N$334  (via drill 0.76 pad 1.52)
  other vias: 21.21,42.73
N$335  (via drill 0.76 pad 1.52)
  other vias: 23.75,42.73
N$336  (via drill 0.76 pad 1.52)
  other vias: 28.83,45.27
N$337  (via drill 0.76 pad 1.52)
  other vias: 13.59,45.27
N$338  (via drill 0.76 pad 1.52)
  other vias: 16.13,45.27
N$339  (via drill 0.76 pad 1.52)
  other vias: 18.67,45.27
N$340  (via drill 0.76 pad 1.52)
  other vias: 21.21,45.27
N$341  (via drill 0.76 pad 1.52)
  other vias: 23.75,45.27
N$342  (via drill 0.76 pad 1.52)
  other vias: 11.13,50.35
N$343  (via drill 0.76 pad 1.52)
  other vias: 8.59,52.89
N$344  (via drill 0.76 pad 1.52)
  other vias: 11.13,52.89
N$345  (via drill 0.76 pad 1.52)
  other vias: 8.59,55.43
N$346  (via drill 0.76 pad 1.52)
  other vias: 11.13,55.43
N$347  (via drill 0.76 pad 1.52)
  other vias: 8.59,57.97
N$348  (via drill 0.76 pad 1.52)
  other vias: 11.13,57.97
N$349  (via drill 0.76 pad 1.52)
  other vias: 8.59,60.51
N$350  (via drill 0.76 pad 1.52)
  other vias: 11.13,60.51
N$351  (via drill 0.76 pad 1.52)
  other vias: 8.59,63.05
N$352  (via drill 0.76 pad 1.52)
  other vias: 11.13,63.05
N$353  (via drill 0.76 pad 1.52)
  other vias: 8.59,65.59
N$354  (via drill 0.76 pad 1.52)
  other vias: 11.13,65.59
N$355  (via drill 0.76 pad 1.52)
  other vias: 8.59,68.13
N$356  (via drill 0.76 pad 1.52)
  other vias: 11.13,68.13
N$357  (via drill 0.76 pad 1.52)
  other vias: 8.59,70.67
N$358  (via drill 0.76 pad 1.52)
  other vias: 11.13,70.67
N$359  (via drill 0.76 pad 1.52)
  other vias: 8.59,73.21
N$360  (via drill 0.76 pad 1.52)
  other vias: 11.13,73.21
N$361  (via drill 0.76 pad 1.52)
  other vias: 8.59,75.75
N$362  (via drill 0.76 pad 1.52)
  other vias: 11.13,75.75
N$363  (via drill 0.76 pad 1.52)
  other vias: 8.59,78.29
N$364  (via drill 0.76 pad 1.52)
  other vias: 11.13,78.29
N$365  (via drill 0.76 pad 1.52)
  other vias: 8.59,80.83
N$366  (via drill 0.76 pad 1.52)
  other vias: 11.13,80.83
N$367  (via drill 0.76 pad 1.52)
  other vias: 8.59,83.37
N$368  (via drill 0.76 pad 1.52)
  other vias: 11.13,83.37
N$369  (via drill 0.76 pad 1.52)
  other vias: 8.59,85.91
N$370  (via drill 0.76 pad 1.52)
  other vias: 11.13,85.91
N$371  (via drill 0.76 pad 1.52)
  other vias: 8.59,88.45
N$372  (via drill 0.76 pad 1.52)
  other vias: 11.13,88.45
N$373  (via drill 0.76 pad 1.52)
  other vias: 8.59,90.99
N$374  (via drill 0.76 pad 1.52)
  other vias: 11.13,90.99
N$375  (via drill 0.76 pad 1.52)
  other vias: 8.59,93.53
N$376  (via drill 0.76 pad 1.52)
  other vias: 11.13,93.53
N$377  (via drill 0.76 pad 1.52)
  other vias: 8.59,96.07
N$378  (via drill 0.76 pad 1.52)
  other vias: 11.13,96.07
N$379  (via drill 0.76 pad 1.52)
  other vias: 8.59,98.61
N$380  (via drill 0.76 pad 1.52)
  other vias: 11.13,98.61
N$381  (via drill 0.76 pad 1.52)
  other vias: 8.59,101.15
N$382  (via drill 0.76 pad 1.52)
  other vias: 11.13,101.15
N$383  (via drill 0.76 pad 1.52)
  other vias: 8.59,103.69
N$384  (via drill 0.76 pad 1.52)
  other vias: 11.13,103.69
N$385  (via drill 0.76 pad 1.52)
  other vias: 8.59,106.23
N$386  (via drill 0.76 pad 1.52)
  other vias: 11.13,106.23
N$387  (via drill 0.76 pad 1.52)
  other vias: 8.59,108.77
N$388  (via drill 0.76 pad 1.52)
  other vias: 11.13,108.77
N$389  (via drill 0.76 pad 1.52)
  other vias: 8.59,111.31
N$390  (via drill 0.76 pad 1.52)
  other vias: 11.13,111.31
N$391  (via drill 0.76 pad 1.52)
  other vias: 8.59,113.85
N$392  (via drill 0.76 pad 1.52)
  other vias: 11.13,113.85
N$393  (via drill 0.76 pad 1.52)
  other vias: 8.59,116.39
N$394  (via drill 0.76 pad 1.52)
  other vias: 11.13,116.39
N$395  (via drill 0.76 pad 1.52)
  other vias: 8.59,118.93
N$396  (via drill 0.76 pad 1.52)
  other vias: 11.13,118.93
N$397  (via drill 0.76 pad 1.52)
  other vias: 8.59,121.47
N$398  (via drill 0.76 pad 1.52)
  other vias: 11.13,121.47
N$399  (via drill 0.76 pad 1.52)
  other vias: 8.59,124.01
N$400  (via drill 0.76 pad 1.52)
  other vias: 11.13,124.01
N$401  (via drill 0.76 pad 1.52)
  other vias: 8.59,126.55
N$402  (via drill 0.76 pad 1.52)
  other vias: 11.13,126.55
N$403  (via drill 0.76 pad 1.52)
  other vias: 8.59,30.03
N$404  (via drill 0.76 pad 1.52)
  other vias: 11.13,30.03
N$405  (via drill 0.76 pad 1.52)
  other vias: 8.59,32.57
N$406  (via drill 0.76 pad 1.52)
  other vias: 11.13,32.57
N$407  (via drill 0.76 pad 1.52)
  other vias: 8.59,35.11
N$408  (via drill 0.76 pad 1.52)
  other vias: 11.13,35.11
N$409  (via drill 0.76 pad 1.52)
  other vias: 8.59,37.65
N$410  (via drill 0.76 pad 1.52)
  other vias: 11.13,37.65
N$411  (via drill 0.76 pad 1.52)
  other vias: 8.59,40.19
N$412  (via drill 0.76 pad 1.52)
  other vias: 11.13,40.19
N$413  (via drill 0.76 pad 1.52)
  other vias: 8.59,42.73
N$414  (via drill 0.76 pad 1.52)
  other vias: 11.13,42.73
N$415  (via drill 0.76 pad 1.52)
  other vias: 8.59,45.27
N$416  (via drill 0.76 pad 1.52)
  other vias: 11.13,45.27
N$417  (via drill 0.76 pad 1.52)
  other vias: 74.43,47.81
N$418  (via drill 0.76 pad 1.52)
  other vias: 76.97,47.81
N$419  (via drill 0.76 pad 1.52)
  other vias: 79.51,47.81
N$420  (via drill 0.76 pad 1.52)
  other vias: 82.05,47.81
N$421  (via drill 0.76 pad 1.52)
  other vias: 74.43,50.35
N$422  (via drill 0.76 pad 1.52)
  other vias: 76.97,50.35
N$423  (via drill 0.76 pad 1.52)
  other vias: 79.51,50.35
N$424  (via drill 0.76 pad 1.52)
  other vias: 82.05,50.35
N$425  (via drill 0.76 pad 1.52)
  other vias: 74.43,52.89
N$426  (via drill 0.76 pad 1.52)
  other vias: 76.97,52.89
N$427  (via drill 0.76 pad 1.52)
  other vias: 79.51,52.89
N$428  (via drill 0.76 pad 1.52)
  other vias: 82.05,52.89
N$429  (via drill 0.76 pad 1.52)
  other vias: 74.43,55.43
N$430  (via drill 0.76 pad 1.52)
  other vias: 76.97,55.43
N$431  (via drill 0.76 pad 1.52)
  other vias: 79.51,55.43
N$432  (via drill 0.76 pad 1.52)
  other vias: 82.05,55.43
N$433  (via drill 0.76 pad 1.52)
  other vias: 74.43,57.97
N$434  (via drill 0.76 pad 1.52)
  other vias: 76.97,57.97
N$435  (via drill 0.76 pad 1.52)
  other vias: 79.51,57.97
N$436  (via drill 0.76 pad 1.52)
  other vias: 82.05,57.97
N$437  (via drill 0.76 pad 1.52)
  other vias: 74.43,60.51
N$438  (via drill 0.76 pad 1.52)
  other vias: 76.97,60.51
N$439  (via drill 0.76 pad 1.52)
  other vias: 79.51,60.51
N$440  (via drill 0.76 pad 1.52)
  other vias: 82.05,60.51
N$441  (via drill 0.76 pad 1.52)
  other vias: 74.43,63.05
N$442  (via drill 0.76 pad 1.52)
  other vias: 76.97,63.05
N$443  (via drill 0.76 pad 1.52)
  other vias: 79.51,63.05
N$444  (via drill 0.76 pad 1.52)
  other vias: 82.05,63.05
N$445  (via drill 0.76 pad 1.52)
  other vias: 74.43,65.59
N$446  (via drill 0.76 pad 1.52)
  other vias: 76.97,65.59
N$447  (via drill 0.76 pad 1.52)
  other vias: 79.51,65.59
N$448  (via drill 0.76 pad 1.52)
  other vias: 82.05,65.59
N$449  (via drill 0.76 pad 1.52)
  other vias: 74.43,68.13
N$450  (via drill 0.76 pad 1.52)
  other vias: 76.97,68.13
N$451  (via drill 0.76 pad 1.52)
  other vias: 79.51,68.13
N$452  (via drill 0.76 pad 1.52)
  other vias: 82.05,68.13
N$453  (via drill 0.76 pad 1.52)
  other vias: 74.43,70.67
N$454  (via drill 0.76 pad 1.52)
  other vias: 76.97,70.67
N$455  (via drill 0.76 pad 1.52)
  other vias: 79.51,70.67
N$456  (via drill 0.76 pad 1.52)
  other vias: 82.05,70.67
N$457  (via drill 0.76 pad 1.52)
  other vias: 74.43,73.21
N$458  (via drill 0.76 pad 1.52)
  other vias: 76.97,73.21
N$459  (via drill 0.76 pad 1.52)
  other vias: 79.51,73.21
N$460  (via drill 0.76 pad 1.52)
  other vias: 82.05,73.21
N$461  (via drill 0.76 pad 1.52)
  other vias: 74.43,75.75
N$462  (via drill 0.76 pad 1.52)
  other vias: 76.97,75.75
N$463  (via drill 0.76 pad 1.52)
  other vias: 79.51,75.75
N$464  (via drill 0.76 pad 1.52)
  other vias: 82.05,75.75
N$465  (via drill 0.76 pad 1.52)
  other vias: 74.43,78.29
N$466  (via drill 0.76 pad 1.52)
  other vias: 76.97,78.29
N$467  (via drill 0.76 pad 1.52)
  other vias: 79.51,78.29
N$468  (via drill 0.76 pad 1.52)
  other vias: 82.05,78.29
N$469  (via drill 0.76 pad 1.52)
  other vias: 74.43,80.83
N$470  (via drill 0.76 pad 1.52)
  other vias: 76.97,80.83
N$471  (via drill 0.76 pad 1.52)
  other vias: 79.51,80.83
N$472  (via drill 0.76 pad 1.52)
  other vias: 82.05,80.83
N$473  (via drill 0.76 pad 1.52)
  other vias: 74.43,83.37
N$474  (via drill 0.76 pad 1.52)
  other vias: 76.97,83.37
N$475  (via drill 0.76 pad 1.52)
  other vias: 79.51,83.37
N$476  (via drill 0.76 pad 1.52)
  other vias: 82.05,83.37
N$477  (via drill 0.76 pad 1.52)
  other vias: 74.43,85.91
N$478  (via drill 0.76 pad 1.52)
  other vias: 76.97,85.91
N$479  (via drill 0.76 pad 1.52)
  other vias: 79.51,85.91
N$480  (via drill 0.76 pad 1.52)
  other vias: 82.05,85.91
N$481  (via drill 0.76 pad 1.52)
  other vias: 74.43,88.45
N$482  (via drill 0.76 pad 1.52)
  other vias: 76.97,88.45
N$483  (via drill 0.76 pad 1.52)
  other vias: 79.51,88.45
N$484  (via drill 0.76 pad 1.52)
  other vias: 82.05,88.45
N$485  (via drill 0.76 pad 1.52)
  other vias: 74.43,90.99
N$486  (via drill 0.76 pad 1.52)
  other vias: 76.97,90.99
N$487  (via drill 0.76 pad 1.52)
  other vias: 79.51,90.99
N$488  (via drill 0.76 pad 1.52)
  other vias: 82.05,90.99
N$489  (via drill 0.76 pad 1.52)
  other vias: 74.43,93.53
N$490  (via drill 0.76 pad 1.52)
  other vias: 76.97,93.53
N$491  (via drill 0.76 pad 1.52)
  other vias: 79.51,93.53
N$492  (via drill 0.76 pad 1.52)
  other vias: 82.05,93.53
N$493  (via drill 0.76 pad 1.52)
  other vias: 74.43,96.07
N$494  (via drill 0.76 pad 1.52)
  other vias: 76.97,96.07
N$495  (via drill 0.76 pad 1.52)
  other vias: 79.51,96.07
N$496  (via drill 0.76 pad 1.52)
  other vias: 82.05,96.07
N$497  (via drill 0.76 pad 1.52)
  other vias: 74.43,98.61
N$498  (via drill 0.76 pad 1.52)
  other vias: 76.97,98.61
N$499  (via drill 0.76 pad 1.52)
  other vias: 79.51,98.61
N$500  (via drill 0.76 pad 1.52)
  other vias: 82.05,98.61
N$501  (via drill 0.76 pad 1.52)
  other vias: 74.43,101.15
N$502  (via drill 0.76 pad 1.52)
  other vias: 76.97,101.15
N$503  (via drill 0.76 pad 1.52)
  other vias: 79.51,101.15
N$504  (via drill 0.76 pad 1.52)
  other vias: 82.05,101.15
N$505  (via drill 0.76 pad 1.52)
  other vias: 74.43,103.69
N$506  (via drill 0.76 pad 1.52)
  other vias: 76.97,103.69
N$507  (via drill 0.76 pad 1.52)
  other vias: 79.51,103.69
N$508  (via drill 0.76 pad 1.52)
  other vias: 82.05,103.69
N$509  (via drill 0.76 pad 1.52)
  other vias: 74.43,106.23
N$510  (via drill 0.76 pad 1.52)
  other vias: 76.97,106.23
N$511  (via drill 0.76 pad 1.52)
  other vias: 79.51,106.23
N$512  (via drill 0.76 pad 1.52)
  other vias: 82.05,106.23
N$513  (via drill 0.76 pad 1.52)
  other vias: 74.43,108.77
N$514  (via drill 0.76 pad 1.52)
  other vias: 76.97,108.77
N$515  (via drill 0.76 pad 1.52)
  other vias: 79.51,108.77
N$516  (via drill 0.76 pad 1.52)
  other vias: 82.05,108.77
N$517  (via drill 0.76 pad 1.52)
  other vias: 74.43,111.31
N$518  (via drill 0.76 pad 1.52)
  other vias: 76.97,111.31
N$519  (via drill 0.76 pad 1.52)
  other vias: 79.51,111.31
N$520  (via drill 0.76 pad 1.52)
  other vias: 82.05,111.31
N$521  (via drill 0.76 pad 1.52)
  other vias: 74.43,113.85
N$522  (via drill 0.76 pad 1.52)
  other vias: 76.97,113.85
N$523  (via drill 0.76 pad 1.52)
  other vias: 79.51,113.85
N$524  (via drill 0.76 pad 1.52)
  other vias: 82.05,113.85
N$525  (via drill 0.76 pad 1.52)
  other vias: 74.43,116.39
N$526  (via drill 0.76 pad 1.52)
  other vias: 76.97,116.39
N$527  (via drill 0.76 pad 1.52)
  other vias: 79.51,116.39
N$528  (via drill 0.76 pad 1.52)
  other vias: 82.05,116.39
N$529  (via drill 0.76 pad 1.52)
  other vias: 74.43,118.93
N$530  (via drill 0.76 pad 1.52)
  other vias: 76.97,118.93
N$531  (via drill 0.76 pad 1.52)
  other vias: 79.51,118.93
N$532  (via drill 0.76 pad 1.52)
  other vias: 82.05,118.93
N$533  (via drill 0.76 pad 1.52)
  other vias: 74.43,121.47
N$534  (via drill 0.76 pad 1.52)
  other vias: 76.97,121.47
N$535  (via drill 0.76 pad 1.52)
  other vias: 79.51,121.47
N$536  (via drill 0.76 pad 1.52)
  other vias: 82.05,121.47
N$537  (via drill 0.76 pad 1.52)
  other vias: 74.43,124.01
N$538  (via drill 0.76 pad 1.52)
  other vias: 76.97,124.01
N$539  (via drill 0.76 pad 1.52)
  other vias: 79.51,124.01
N$540  (via drill 0.76 pad 1.52)
  other vias: 82.05,124.01
N$541  (via drill 0.76 pad 1.52)
  other vias: 74.43,126.55
N$542  (via drill 0.76 pad 1.52)
  other vias: 76.97,126.55
N$543  (via drill 0.76 pad 1.52)
  other vias: 79.51,126.55
N$544  (via drill 0.76 pad 1.52)
  other vias: 82.05,126.55
N$545  (via drill 0.76 pad 1.52)
  other vias: 74.43,129.09
N$546  (via drill 0.76 pad 1.52)
  other vias: 76.97,129.09
N$547  (via drill 0.76 pad 1.52)
  other vias: 79.51,129.09
N$548  (via drill 0.76 pad 1.52)
  other vias: 82.05,129.09
N$549  (via drill 0.76 pad 1.52)
  other vias: 74.43,131.63
N$550  (via drill 0.76 pad 1.52)
  other vias: 76.97,131.63
N$551  (via drill 0.76 pad 1.52)
  other vias: 79.51,131.63
N$552  (via drill 0.76 pad 1.52)
  other vias: 82.05,131.63
N$553  (via drill 0.76 pad 1.52)
  other vias: 74.43,134.17
N$554  (via drill 0.76 pad 1.52)
  other vias: 76.97,134.17
N$555  (via drill 0.76 pad 1.52)
  other vias: 79.51,134.17
N$556  (via drill 0.76 pad 1.52)
  other vias: 82.05,134.17
N$557  (via drill 0.76 pad 1.52)
  other vias: 74.43,32.57
N$558  (via drill 0.76 pad 1.52)
  other vias: 76.97,32.57
N$559  (via drill 0.76 pad 1.52)
  other vias: 79.51,32.57
N$560  (via drill 0.76 pad 1.52)
  other vias: 82.05,32.57
N$561  (via drill 0.76 pad 1.52)
  other vias: 74.43,35.11
N$562  (via drill 0.76 pad 1.52)
  other vias: 76.97,35.11
N$563  (via drill 0.76 pad 1.52)
  other vias: 79.51,35.11
N$564  (via drill 0.76 pad 1.52)
  other vias: 82.05,35.11
N$565  (via drill 0.76 pad 1.52)
  other vias: 74.43,37.65
N$566  (via drill 0.76 pad 1.52)
  other vias: 76.97,37.65
N$567  (via drill 0.76 pad 1.52)
  other vias: 79.51,37.65
N$568  (via drill 0.76 pad 1.52)
  other vias: 82.05,37.65
N$569  (via drill 0.76 pad 1.52)
  other vias: 74.43,40.19
N$570  (via drill 0.76 pad 1.52)
  other vias: 76.97,40.19
N$571  (via drill 0.76 pad 1.52)
  other vias: 79.51,40.19
N$572  (via drill 0.76 pad 1.52)
  other vias: 82.05,40.19
N$573  (via drill 0.76 pad 1.52)
  other vias: 74.43,42.73
N$574  (via drill 0.76 pad 1.52)
  other vias: 76.97,42.73
N$575  (via drill 0.76 pad 1.52)
  other vias: 79.51,42.73
N$576  (via drill 0.76 pad 1.52)
  other vias: 82.05,42.73
N$577  (via drill 0.76 pad 1.52)
  other vias: 74.43,45.27
N$578  (via drill 0.76 pad 1.52)